# Altium schematic sheet SheetMicrocontroller.SchDoc
size A; DocumentNumber: 5; SheetNumber: 5; SheetTotal: 5
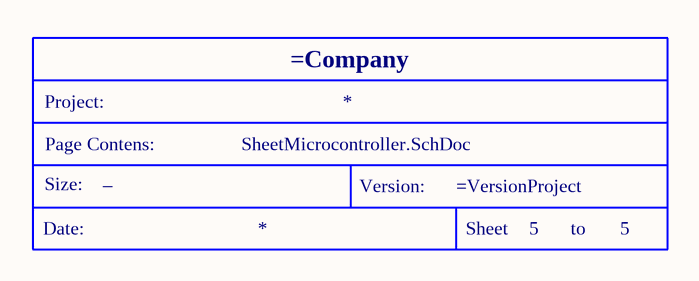
[diagram p0: SheetMicrocontroller.SchDoc]

## Parts
*  SizePage: _  (hidden comment: TitleBlock)  (graphical)

## Notes on the sheet
- (in symbol TitleBlock) Project:; Page Contens:; Size:; Version:; Date:; Sheet; to